# EasyEDA schematic SCH_shield_test_2024-01-07.json
TITLE: TBAG Procedures trainer; REV: 1.0; Date: 2024-01-04; Sheet: 1/1; Drawn By: svenhancock; Company: The Buccaneer Aviation Group
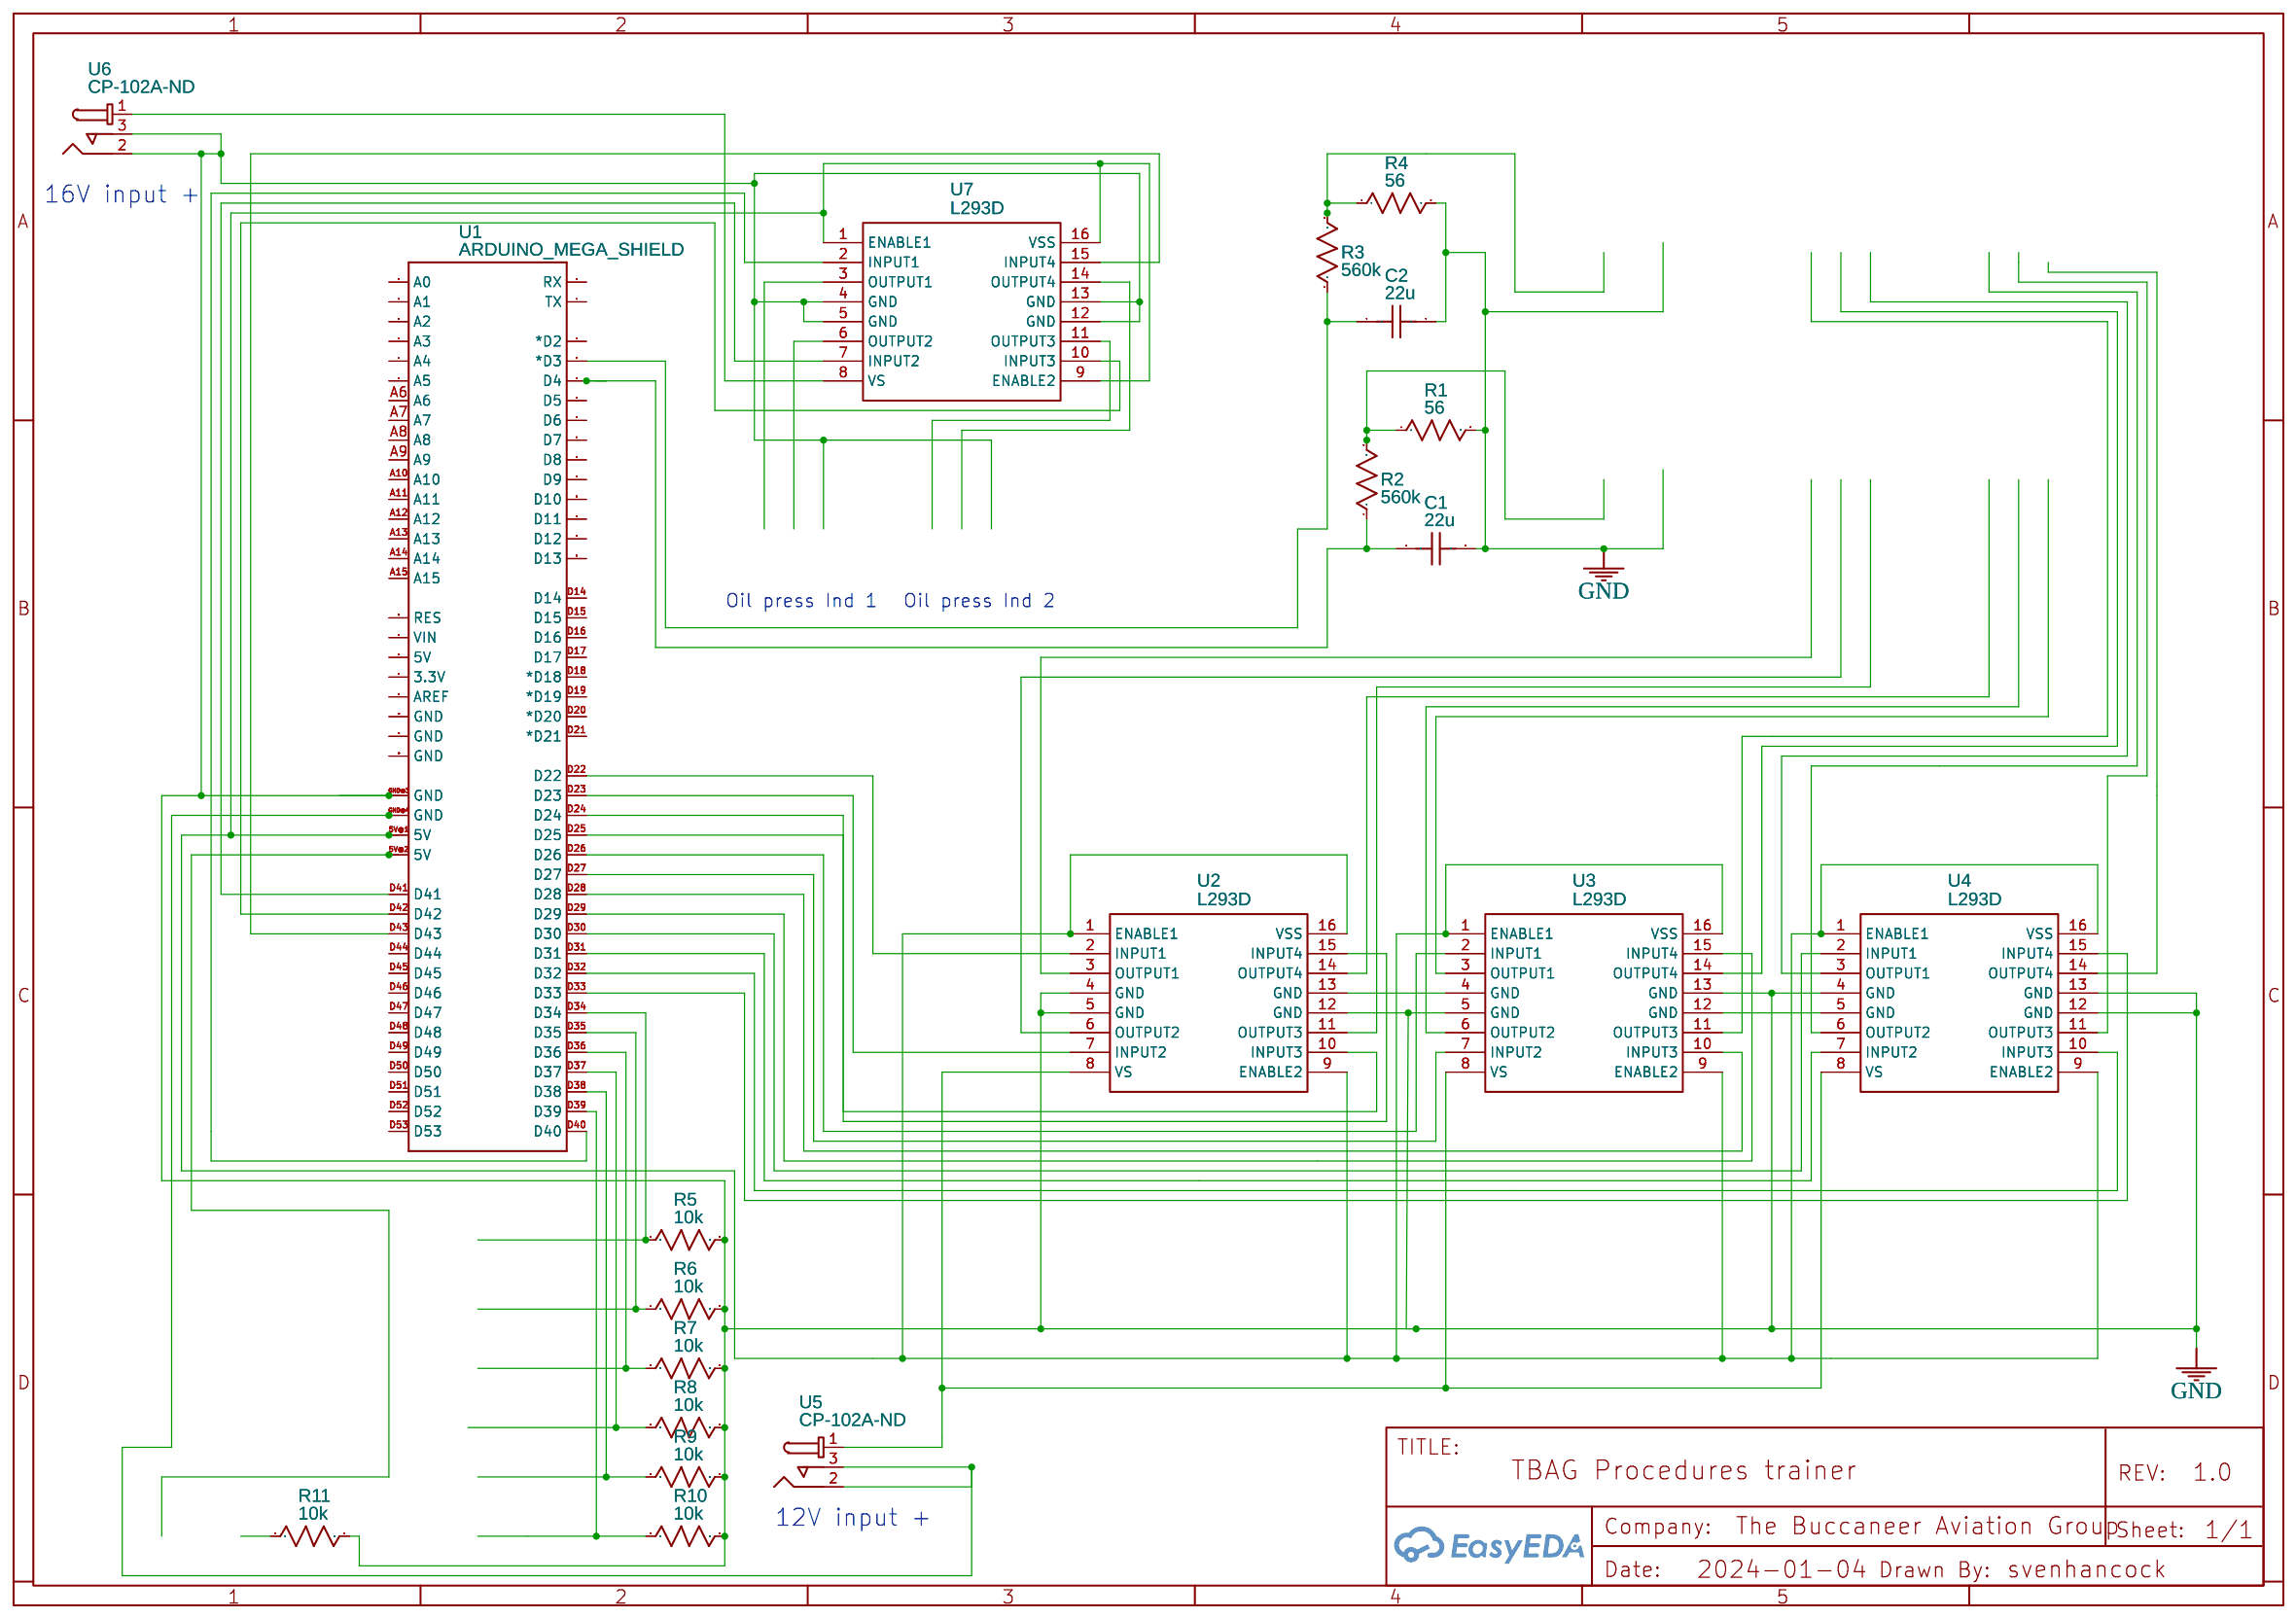
[diagram p0: schematic sheet]

## Parts
C1  22u  [C0603]
C2  22u  [C0603]
R1  56  [R0603]
R2  560k  [R0603]
R3  560k  [R0603]
R4  56  [R0603]
R5  10k  [R0603]
R6  10k  [R0603]
R7  10k  [R0603]
R8  10k  [R0603]
R9  10k  [R0603]
R10  10k  [R0603]
R11  10k  [R0603]
U1  ARDUINO_MEGA_SHIELD  [ARDUINO_MEGA_SHIELD]
U2  L293D  [DIP-16_L20.0-W6.4-P2.54-LS7.6-BL]
U3  L293D  [DIP-16_L20.0-W6.4-P2.54-LS7.6-BL]
U4  L293D  [DIP-16_L20.0-W6.4-P2.54-LS7.6-BL]
U5  CP-102A-ND  [BARREL_JACK_5.5MMODX2.1MMID_PJ-102A]
U6  CP-102A-ND  [BARREL_JACK_5.5MMODX2.1MMID_PJ-102A]
U7  L293D  [DIP-16_L20.0-W6.4-P2.54-LS7.6-BL]

## Library data of the parts
C1 C2 = C_0603_US: Contributor: LCEDA_Lib
R1-R11 = R_0603_US: Contributor: LCEDA_Lib
U1 = ARDUINO_MEGA_SHIELD
U2-U4 U7 = L293D: Contributor: pitreluc; Supplier: LCSC; Manufacturer: ST(意法半导体); Supplier Part: C12340; JLCPCB Part Class: Extended Part
U5 U6 = CP-102A-ND: Contributor: sgpars

## Nets
GND: C1.2 C2.2 R1.2 R4.2 R5.2 R6.2 R7.2 R8.2 R9.2 R10.2 R11.2 U1.GND@3(GND) U2.4(GND) U2.5(GND) U2.12(GND) U3.5(GND) U3.13(GND) U4.4(GND) U4.12(GND) U4.13(GND) U6.2 U6.3 U7.4(GND) U7.5(GND) U7.12(GND) U7.13(GND)
Net-(C1-1): C1.1 R2.1 U1.D4
Net-(C2-1): C2.1 R3.1 U1.D3(*D3)
Net-(R1-1): R1.1 R2.2
Net-(R3-2): R3.2 R4.1
Net-(R5-1): R5.1 U1.D34
Net-(R6-1): R6.1 U1.D35
Net-(R7-1): R7.1 U1.D36
Net-(R8-1): R8.1 U1.D37
Net-(R9-1): R9.1 U1.D38
Net-(R10-1): R10.1 U1.D39
Net-(U1-5V@1): U1.5V@1(5V) U2.1(ENABLE1) U2.9(ENABLE2) U2.16(VSS) U3.1(ENABLE1) U3.9(ENABLE2) U3.16(VSS) U4.1(ENABLE1) U4.9(ENABLE2) U4.16(VSS) U7.1(ENABLE1) U7.9(ENABLE2) U7.16(VSS)
Net-(U1-D22): U1.D22 U2.2(INPUT1)
Net-(U1-D23): U1.D23 U2.7(INPUT2)
Net-(U1-D24): U1.D24 U2.10(INPUT3)
Net-(U1-D25): U1.D25 U2.15(INPUT4)
Net-(U1-D26): U1.D26 U3.2(INPUT1)
Net-(U1-D27): U1.D27 U3.7(INPUT2)
Net-(U1-D28): U1.D28 U3.10(INPUT3)
Net-(U1-D29): U1.D29 U3.15(INPUT4)
Net-(U1-D30): U1.D30 U4.2(INPUT1)
Net-(U1-D31): U1.D31 U4.7(INPUT2)
Net-(U1-D32): U1.D32 U4.10(INPUT3)
Net-(U1-D33): U1.D33 U4.15(INPUT4)
Net-(U1-D40): U1.D40 U7.2(INPUT1)
Net-(U1-D41): U1.D41 U7.7(INPUT2)
Net-(U1-D42): U1.D42 U7.10(INPUT3)
Net-(U1-D43): U1.D43 U7.15(INPUT4)
Net-(U1-GND@4): U1.GND@4(GND) U5.2 U5.3
Net-(U2-8): U2.8(VS) U3.8(VS) U4.8(VS) U5.1
Net-(U2-13): U2.13(GND) U3.4(GND)
Net-(U3-12): U3.12(GND) U4.5(GND)
Net-(U6-1): U6.1 U7.8(VS)

Not connected (* = marked no-connect by the designer): R11 1; U1 3.3V 5V@0(5V) 5V@2(5V) A0 A1 A2 A3 A4 A5 A6 A7 A8 A9 A10 A11 A12 A13 A14 A15 AREF D2(*D2) D5 D6 D7 D8 D9 D10 D11 D12 D13 D14 D15 D16 D17 D18(*D18) D19(*D19) D20(*D20) D21(*D21) D44 D45 D46 D47 D48 D49 D50 D51 D52 D53 GND@0(GND) GND@1(GND) GND@2(GND) RES RX TX VIN; U2 3(OUTPUT1) 6(OUTPUT2) 11(OUTPUT3) 14(OUTPUT4); U3 3(OUTPUT1) 6(OUTPUT2) 11(OUTPUT3) 14(OUTPUT4); U4 3(OUTPUT1) 6(OUTPUT2) 11(OUTPUT3) 14(OUTPUT4); U7 3(OUTPUT1) 6(OUTPUT2) 11(OUTPUT3) 14(OUTPUT4)

## Notes on the sheet
- 16V input +
- Oil press Ind 1
- Oil press Ind 2
- 12V input +
